# Altium schematic sheet uC.SchDoc
size A3
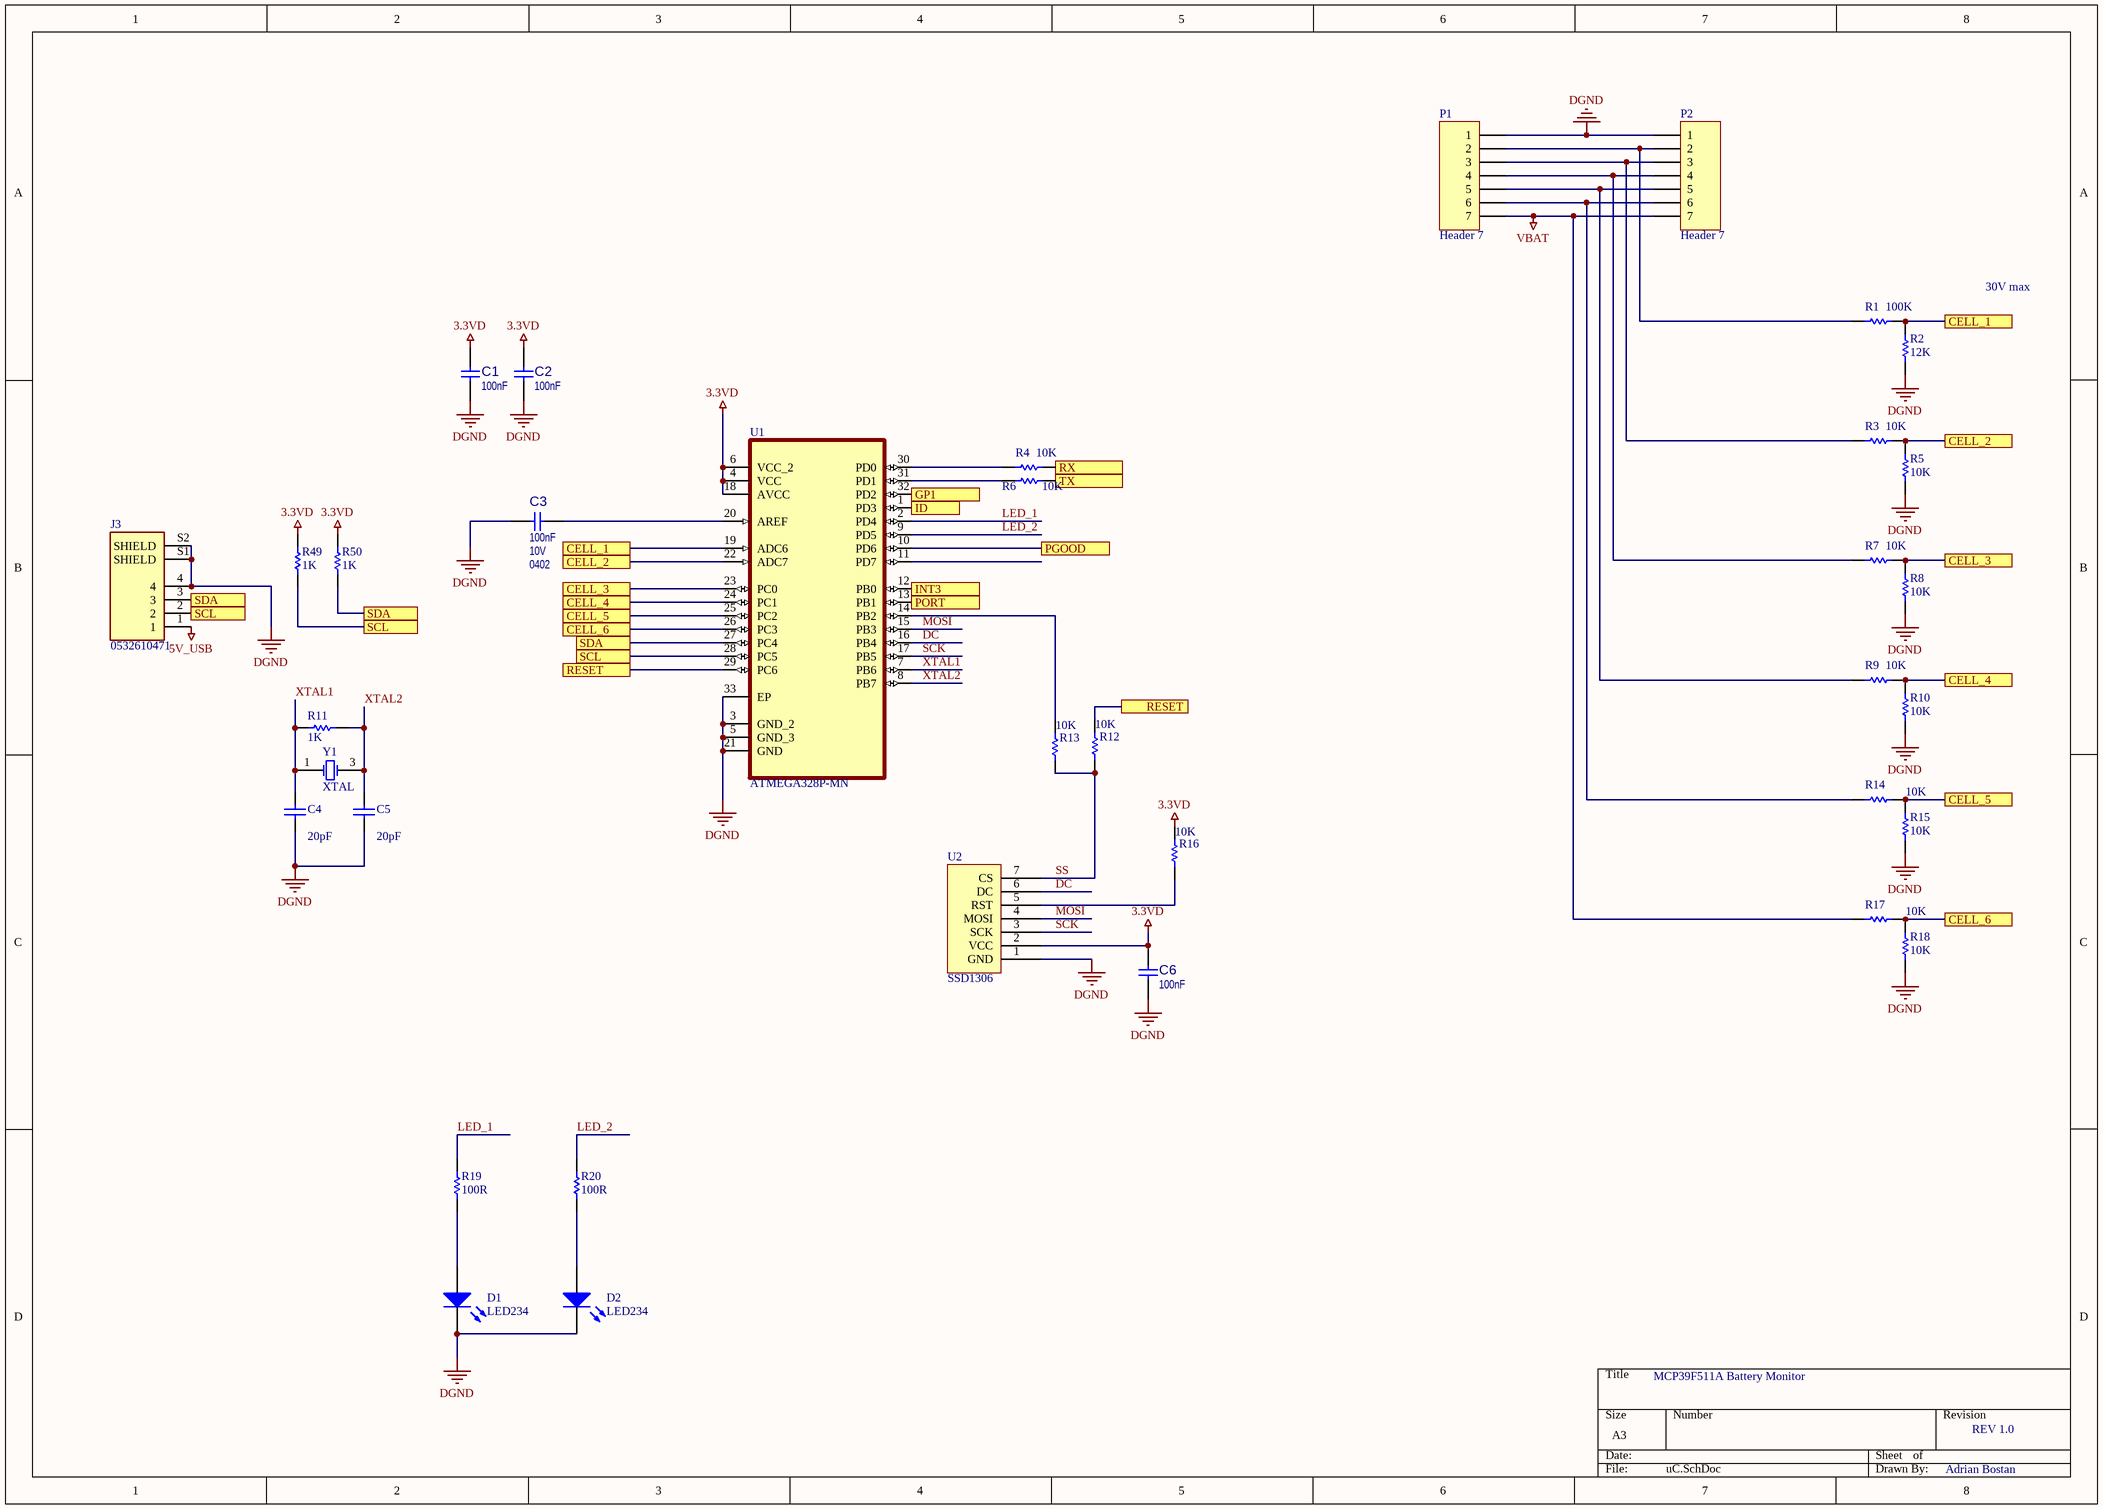
[diagram p0: uC.SchDoc]

## Parts
C1  value 100nF  [CAP0603M]
C2  value 100nF  [CAP0603M]
C3  value 100nF  Voltage: 10V  Package: 0402  [CAP0603M]
C4  value 20pF  [CAP0603M]  (hidden comment: Cap)
C5  value 20pF  [CAP0603M]  (hidden comment: Cap)
C6  value 100nF  [CAP0603M]
D1  LED234  [LED0603M_RED]
D2  LED234  [LED0603M_GREEN]
J3  0532610471  [0532610471]
P1  Header 7  [S7B-XH-A-1]
P2  Header 7  [S7B-XH-A-1]
R1  value 100K  [RES0603M]  (hidden comment: Res1)
R2  value 12K  [RES0603M]  (hidden comment: Res1)
R3  value 10K  [RES0603M]  (hidden comment: Res1)
R4  value 10K  [RES0603M]  (hidden comment: Res1)
R5  value 10K  [RES0603M]  (hidden comment: Res1)
R6  value 10K  [RES0603M]  (hidden comment: Res1)
R7  value 10K  [RES0603M]  (hidden comment: Res1)
R8  value 10K  [RES0603M]  (hidden comment: Res1)
R9  value 10K  [RES0603M]  (hidden comment: Res1)
R10  value 10K  [RES0603M]  (hidden comment: Res1)
R11  value 1K  [RES0603M]  (hidden comment: Res1)
R12  value 10K  [RES0603M]  (hidden comment: Res1)
R13  value 10K  [RES0603M]  (hidden comment: Res1)
R14  value 10K  [RES0603M]  (hidden comment: Res1)
R15  value 10K  [RES0603M]  (hidden comment: Res1)
R16  value 10K  [RES0603M]  (hidden comment: Res1)
R17  value 10K  [RES0603M]  (hidden comment: Res1)
R18  value 10K  [RES0603M]  (hidden comment: Res1)
R19  value 100R  [RES0603M]  (hidden comment: Res1)
R20  value 100R  [RES0603M]  (hidden comment: Res1)
R49  value 1K  [RES0603M]  (hidden comment: Res1)
R50  value 1K  [RES0603M]  (hidden comment: Res1)
U1  ATMEGA328P-MN  [QFN50P500X500X100-33N]
U2  SSD1306  [SSD1306]
Y1  XTAL  [ABM3B]

## Ports
CELL_1, CELL_2, CELL_3, CELL_4, CELL_5, CELL_6, GP1, ID, INT3, PGOOD, PORT, RESET, RX, SCL, SDA, TX

## Nets
3.3VD: C1.1 C2.1 C6.1 R16.1 R49.1 R50.1 U1.4(VCC) U1.6(VCC_2) U1.18(AVCC) U2.2(VCC)
5V_USB: J3.1
DGND: C1.2 C2.2 C3.2 C4.1 C5.1 C6.2 D1.2(K) D2.2(K) J3.4 J3.S1(SHIELD) J3.S2(SHIELD) P1.1 P2.1 R2.2 R5.2 R8.2 R10.2 R15.2 R18.2 U1.3(GND_2) U1.5(GND_3) U1.21(GND) U1.33(EP) U2.1(GND)
VBAT: P1.7 P2.7 R17.2
CELL_1: R1.1 R2.1 U1.19(ADC6) ; port CELL_1
CELL_2: R3.1 R5.1 U1.22(ADC7) ; port CELL_2
CELL_3: R7.1 R8.1 U1.23(PC0) ; port CELL_3
CELL_4: R9.1 R10.1 U1.24(PC1) ; port CELL_4
CELL_5: R14.1 R15.1 U1.25(PC2) ; port CELL_5
CELL_6: R17.1 R18.1 U1.26(PC3) ; port CELL_6
DC: U1.16(PB4) U2.6(DC)
GP1: U1.32(PD2) ; port GP1
ID: U1.1(PD3) ; port ID
INT3: U1.12(PB0) ; port INT3
LED_1: R19.2 U1.2(PD4)
LED_2: R20.2 U1.9(PD5)
MOSI: U1.15(PB3) U2.4(MOSI)
PGOOD: U1.10(PD6) ; port PGOOD
PORT: U1.13(PB1) ; port PORT
RESET: R12.1 U1.29(PC6) ; port RESET
RX: R4.1 ; port RX
SCK: U1.17(PB5) U2.3(SCK)
SCL: J3.2 R49.2 U1.28(PC5) ; port SCL
SDA: J3.3 R50.2 U1.27(PC4) ; port SDA
SS: R12.2 R13.2 U2.7(CS)
TX: R6.1 ; port TX
XTAL1: C4.2 R11.2 U1.7(PB6) Y1.1(OSC1)
XTAL2: C5.2 R11.1 U1.8(PB7) Y1.3(OSC2)
NetC3_1: C3.1 U1.20(AREF)
NetD1_1: D1.1(A) R19.1
NetD2_1: D2.1(A) R20.1
NetP1_2: P1.2 P2.2 R1.2
NetP1_3: P1.3 P2.3 R3.2
NetP1_4: P1.4 P2.4 R7.2
NetP1_5: P1.5 P2.5 R9.2
NetP1_6: P1.6 P2.6 R14.2
NetR4_2: R4.2 U1.30(PD0)
NetR6_2: R6.2 U1.31(PD1)
NetR13_1: R13.1 U1.14(PB2)
NetR16_2: R16.2 U2.5(RST)

Not connected (* = marked no-connect by the designer): U1 11(PD7)

## Notes on the sheet
- 30V max
- MCP39F511A Battery Monitor
- REV 1.0
- Adrian Bostan

## Library data of the parts
C1-C3 C6 = CAP1183: Capacitor; Manufacturer 1: Murata Electronics North America; Manufacturer Part Number 1: GRM155R61A105KE15D; Description_: CAP CER 1uF 10V 10% X5R SMD 0402; Dev Tools Status: Production; Tolerance: 10%; Temperature Coeffcient: X5R; Type: Ceramic; Owner: Aaron VanDuerm; Populated: YES; MCHP-ID: CAP1183; Revision: 0; Symbol: Capacitor NP; Status: MCL Design; ComponentLink1URL: https://chn-vm-apps.microchip.com/mchprepo/parts/Datasheets/CL05A105KP5NNNC1.pdf; ComponentLink1Description: SVN Datasheet; ComponentLink2URL: C:\ALTIUM_WORK\00001_MCHP-CDB\Datasheets\CL05A105KP5NNNC1.pdf; ComponentLink2Description: Local Datasheet; ComponentLink3URL: C:\ALTIUM_WORK\00001_MCHP-CDB\Library\LibraryRefs\Capacitor NP.SchLib; ComponentLink3Description: Open Symbol; ComponentLink4URL: C:\ALTIUM_WORK\00001_MCHP-CDB\Library\Footprints\CAP_C_0402.PcbLib; ComponentLink4Description: Open Footprint; ComponentLink5Description: Open Footprint 2; ComponentLink6Description: Open Footprint 3; ComponentLink7Description: Open Footprint 4; Operating Temperature: -55C to +85C; Category: Capacitor; Supplier 1: Digi-Key; Supplier Part Number 1: 490-3890-1-ND; Quantity Override: 1; Manufacturer 2: Samsung; Manufacturer Part Number 2: CL05A105KP5NNNC; Supplier 2: Digi-Key; Supplier Part Number 2: 1276-1076-2-ND
C4 C5 = Cap: Capacitor; Published: 8-Jun-2000; LatestRevisionDate: 17-Jul-2002; LatestRevisionNote: Re-released for DXP Platform.; PackageReference: RAD-0.3; Publisher: Altium Limited
D1 D2 = LED0: Typical INFRARED GaAs LED; Published: 8-Jun-2000; LatestRevisionDate: 08-Jul-2005; LatestRevisionNote: Mech Layer 1 removed.; PackageReference: LED-0; Publisher: Altium Limited; PackageDescription: LED; 2 Leads
J3 = 0532610471: Picoblade Connector, 4 Circuit Single Row, Right Angle Surface Mount SMT PCB; MF: Molex; MP: 0532610471; Digi-Key_Purchase_URL: https://www.digikey.com/product-detail/en/molex/0532610471/WM7622CT-ND/699109?utm_source=snapeda&utm_medium=aggregator&utm_campaign=symbol; Package: None; Digi-Key_Part_Number: WM7622CT-ND; Value: *; SnapEDA_Link: https://www.snapeda.com/parts/0532610471/Molex/view-part/542805/?ref=snap
P1 P2 = Header 7: Header, 7-Pin; LatestRevisionDate: 17-Jul-2002; LatestRevisionNote: Re-released for DXP Platform.; Publisher: Altium Limited
R1-R20 R49 R50 = Res1: Resistor; Published: 8-Jun-2000; LatestRevisionDate: 17-Jul-2002; LatestRevisionNote: Re-released for DXP Platform.; PackageReference: AXIAL-0.3; Publisher: Altium Limited; PackageDescription: Axial Device, Thru-Hole; 2 Leads; 0.3 in Pin Spacing
U1 = ATMEGA328P-MN: AVR AVRÂ® ATmega Microcontroller IC 8-Bit 20MHz 32KB _16K x 16_ FLASH 32-VQFN _5x5_; MF: Microchip; Price: None; Value: *; Package: VQFN-32 Microchip; SnapEDA_Link: https://www.snapeda.com/parts/ATMEGA328P-MN/Microchip/view-part/652121/?ref=snap; MP: ATMEGA328P-MN; Availability: Unavailable
Y1 = XTAL: Crystal Oscillator; Published: 8-Jun-2000; LatestRevisionDate: 17-Jul-2002; LatestRevisionNote: Re-released for DXP Platform.; PackageReference: R38; Publisher: Altium Limited